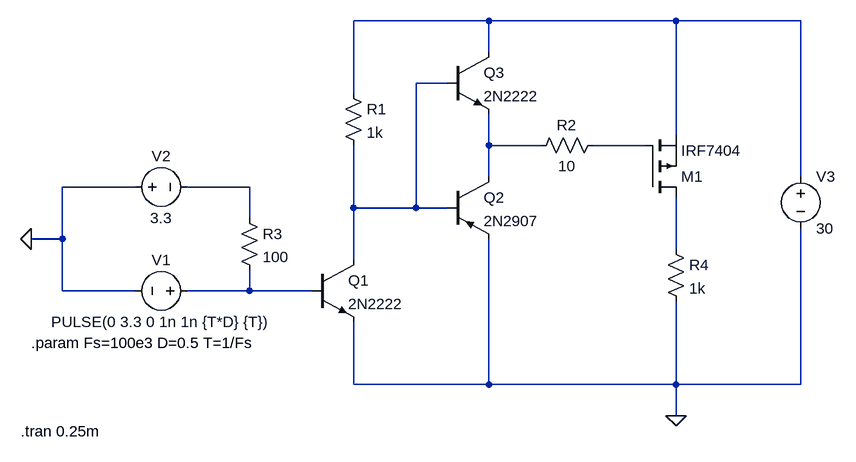
[diagram p0: schematic PMOS_Gate.asc]
PMOS_Gate.asc, the LTspice schematic file:
Version 4.1
SHEET 1 880 680
WIRE 272 0 64 0
WIRE 560 0 272 0
WIRE 752 0 560 0
WIRE 272 48 272 0
WIRE 208 96 160 96
WIRE 64 112 64 0
WIRE 560 176 560 0
WIRE 272 192 272 144
WIRE 352 192 272 192
WIRE 512 192 432 192
WIRE 272 240 272 192
WIRE 752 240 752 0
WIRE -272 256 -384 256
WIRE -96 256 -192 256
WIRE 64 288 64 192
WIRE 160 288 160 96
WIRE 160 288 64 288
WIRE 208 288 160 288
WIRE -96 304 -96 256
WIRE -384 336 -384 256
WIRE -384 336 -432 336
WIRE 560 352 560 272
WIRE 64 368 64 288
WIRE -384 416 -384 336
WIRE -272 416 -384 416
WIRE -96 416 -96 384
WIRE -96 416 -192 416
WIRE 0 416 -96 416
WIRE 64 560 64 464
WIRE 272 560 272 336
WIRE 272 560 64 560
WIRE 560 560 560 432
WIRE 560 560 272 560
WIRE 752 560 752 320
WIRE 752 560 560 560
WIRE 560 608 560 560
FLAG -432 336 0
FLAG 560 608 0
SYMBOL npn 0 368 R0
SYMATTR InstName Q1
SYMATTR Value 2N2222
SYMBOL pnp 208 240 R0
SYMATTR InstName Q2
SYMATTR Value 2N2907
SYMBOL npn 208 48 R0
SYMATTR InstName Q3
SYMATTR Value 2N2222
SYMBOL res 48 96 R0
SYMATTR InstName R1
SYMATTR Value 1k
SYMBOL res 448 176 R90
WINDOW 0 0 56 VBottom 2
WINDOW 3 32 56 VTop 2
SYMATTR InstName R2
SYMATTR Value 10
SYMBOL pmos 512 272 M180
SYMATTR InstName M1
SYMATTR Value IRF7404
SYMBOL res -112 288 R0
SYMATTR InstName R3
SYMATTR Value 100
SYMBOL voltage -176 416 R90
WINDOW 0 -32 56 VBottom 2
WINDOW 3 32 56 VTop 2
WINDOW 123 0 0 Left 0
WINDOW 39 0 0 Left 0
SYMATTR InstName V1
SYMATTR Value PULSE(0 3.3 0 1n 1n {T*D} {T})
SYMBOL voltage -288 256 R270
WINDOW 0 32 56 VTop 2
WINDOW 3 -32 56 VBottom 2
WINDOW 123 0 0 Left 0
WINDOW 39 0 0 Left 0
SYMATTR InstName V2
SYMATTR Value 3.3
SYMBOL res 544 336 R0
SYMATTR InstName R4
SYMATTR Value 1k
SYMBOL voltage 752 224 R0
WINDOW 123 0 0 Left 0
WINDOW 39 0 0 Left 0
SYMATTR InstName V3
SYMATTR Value 30
TEXT -432 496 Left 2 !.param Fs=100e3 D=0.5 T=1/Fs
TEXT -448 632 Left 2 !.tran 0.25m

The netlist it stands for:
* PMOS_Gate.asc
Q1 N002 N007 0 0 2N2222
Q2 N003 N002 0 0 2N2907
Q3 N001 N002 N003 0 2N2222
R1 N001 N002 1k
R2 N004 N003 10
M1 N006 N004 N001 N001 IRF7404
R3 N005 N007 100
V1 N007 0 PULSE(0 3.3 0 1n 1n {T*D} {T})
V2 0 N005 3.3
R4 N006 0 1k
V3 N001 0 30
.model NPN NPN
.model PNP PNP
.lib standard.bjt
.model NMOS NMOS
.model PMOS PMOS
.lib standard.mos
.param Fs=100e3 D=0.5 T=1/Fs
.tran 0.25m
.backanno
.end